# EasyEDA Pro project tinyProto_2026-02-20.epro

# Schematic tinyProto
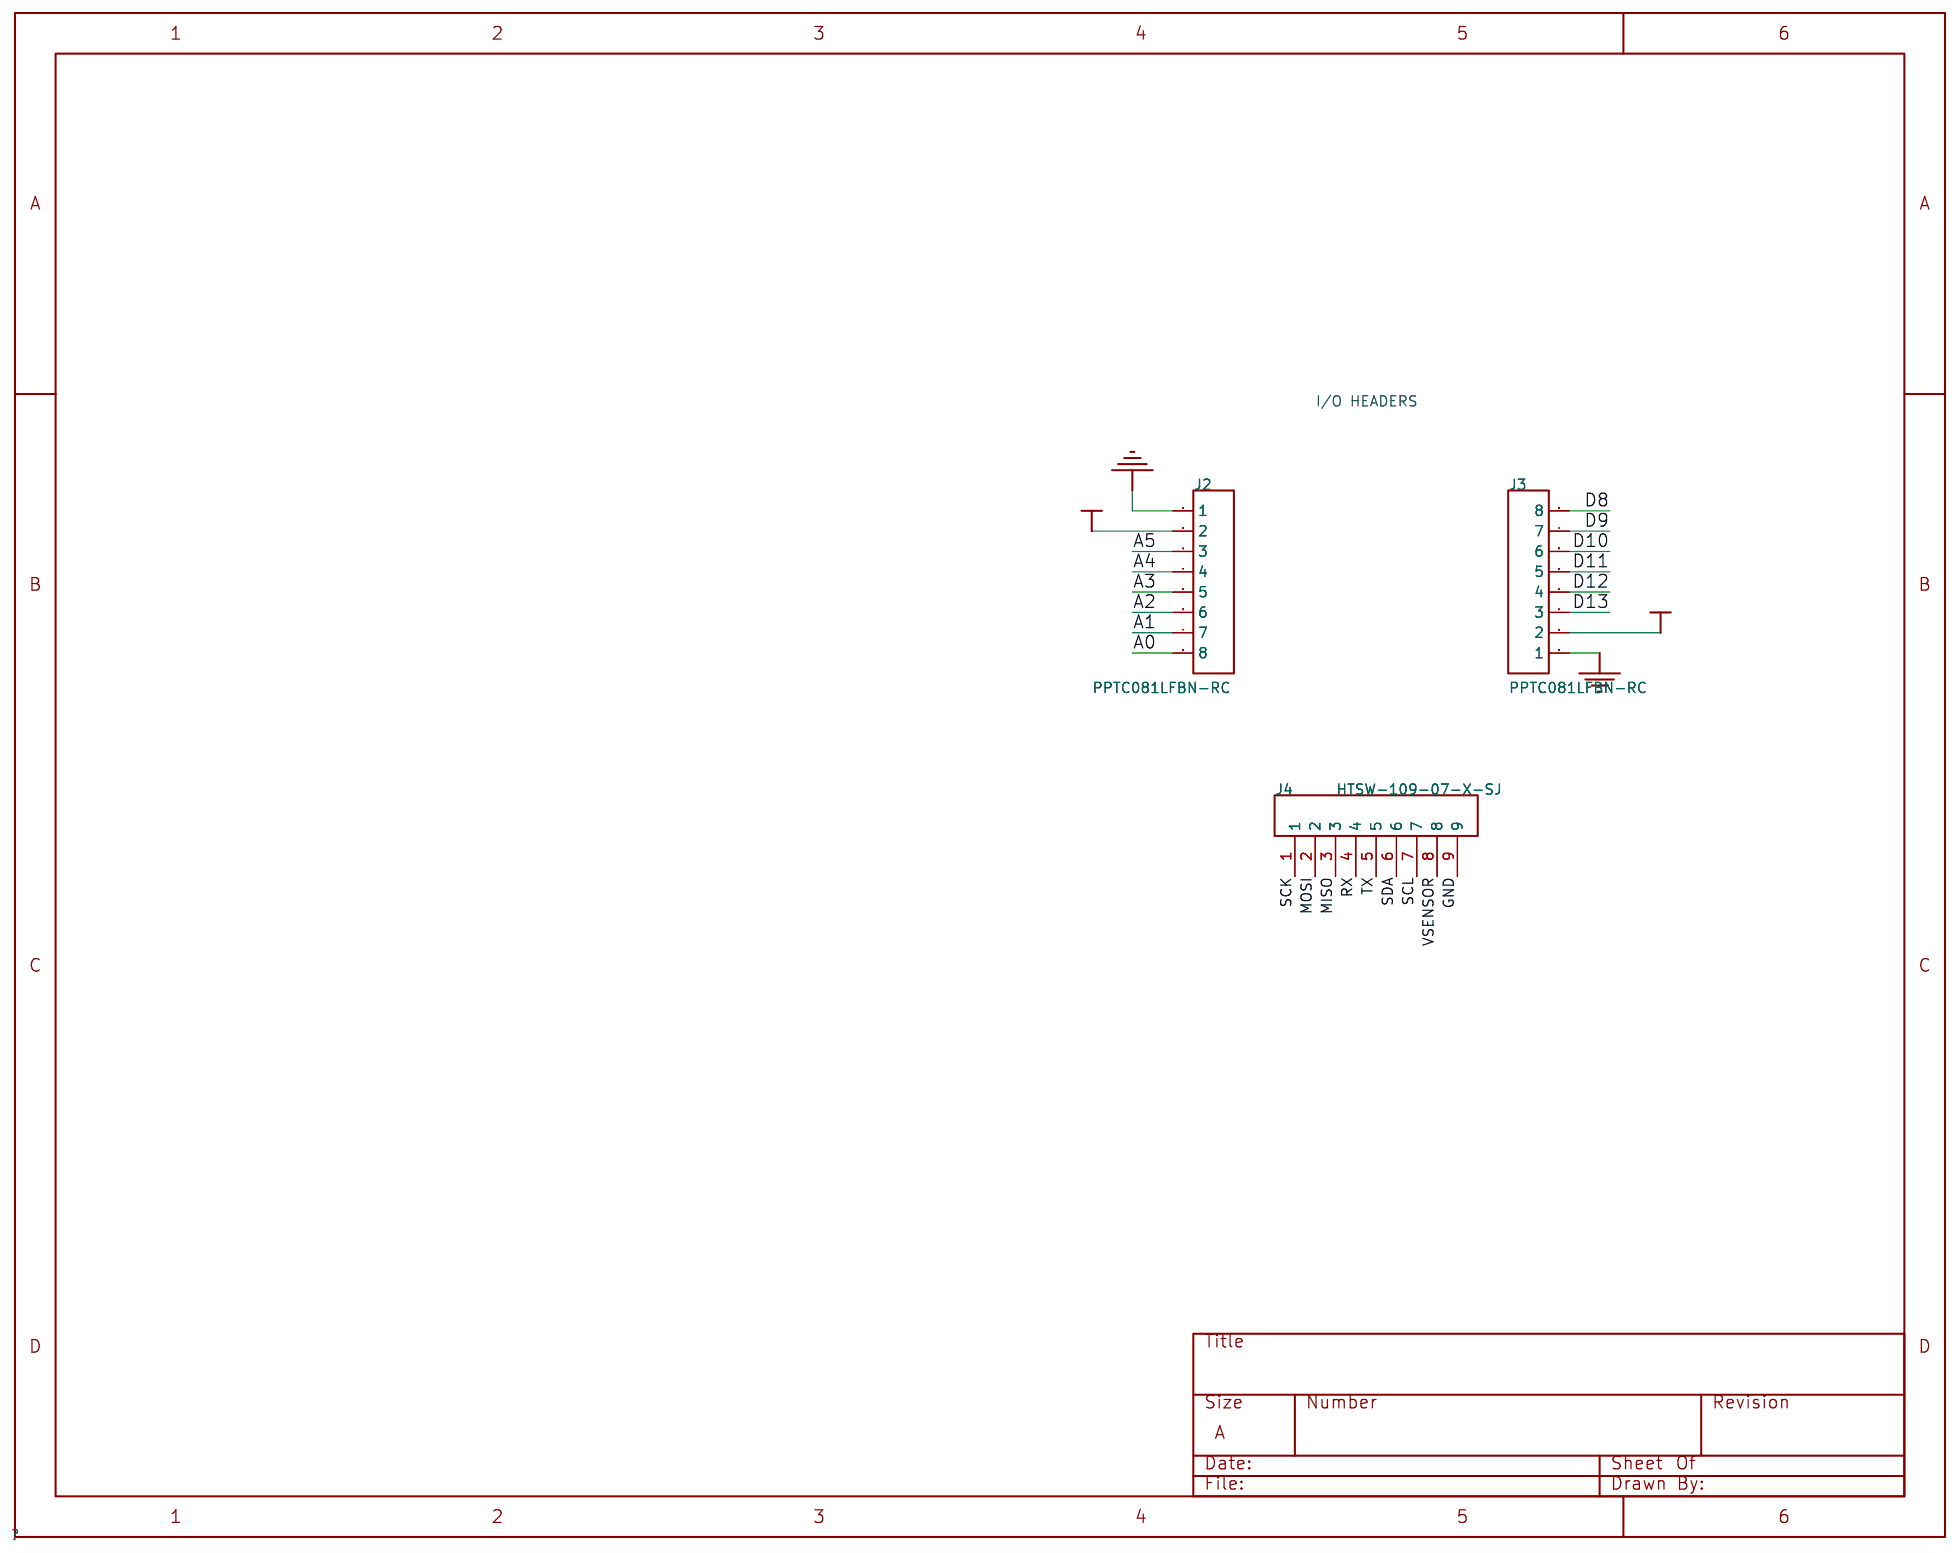
[diagram p0: schematic sheet]

## Parts
J2  PPTC081LFBN-RC  [8_PIN_100MIL - Female]
J3  PPTC081LFBN-RC  [8_PIN_100MIL - Female]
J4  HTSW-109-07-X-SJ  [JM-9_HTSW-109-07-X-S]

## Library data of the parts
J2 J3 = PPTC081LFBN-RC: 8 Position Header Connector 0.100" (2.54mm) Through Hole Tin; Digikey Link: https://www.digikey.com/product-detail/en/PPTC081LFBN-RC/S7006-ND/810147/?itemSeq=304982354; Type: Extended; LCSC Part#: C27438; Design Item ID: JF_8_PIN_FEMALE; Library Name: ECEN5730Lib_2023_05_DS (2)
J4 = HTSW-109-07-X-SJ: 2.54mm Black 1x9P Straight,P=2.54mm Pin Headers; MFR PART #: PZ254-1-09-Z-8.5; LCSC PART#: C2894932; Design Item ID: JM_9_PIN_MALE; Library Name: ECEN5730Lib_2023_05_DS (2)

## Nets
3V3: J2.2 J3.2
GND: J2.1 J3.1 J4.9
A0: J2.8
A1: J2.7
A2: J2.6
A3: J2.5
A4: J2.4
A5: J2.3
D8: J3.8
D9: J3.7
D10: J3.6
D11: J3.5
D12: J3.4
D13: J3.3
MISO: J4.3
MOSI: J4.2
RX: J4.4
SCK: J4.1
SCL: J4.7
SDA: J4.6
TX: J4.5
VSENSOR: J4.8

## Notes on the sheet
- I/O HEADERS

# Board tinyProto
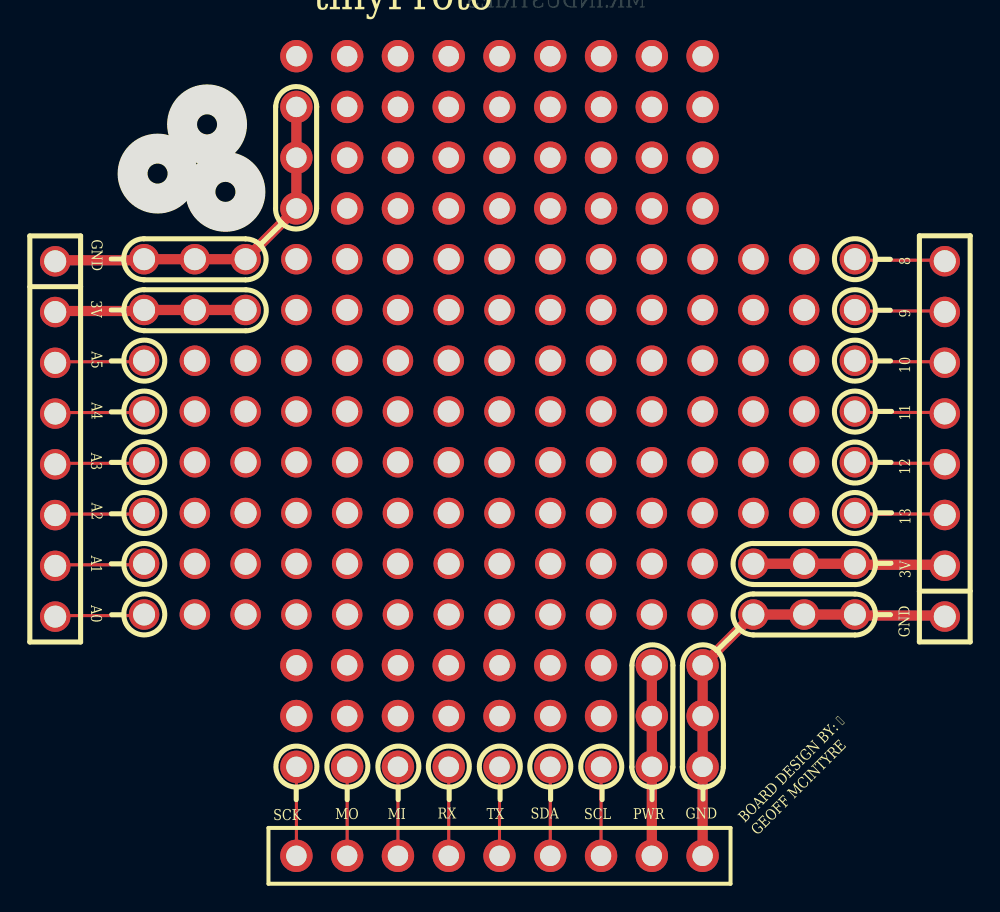
[diagram p1: board, top side]
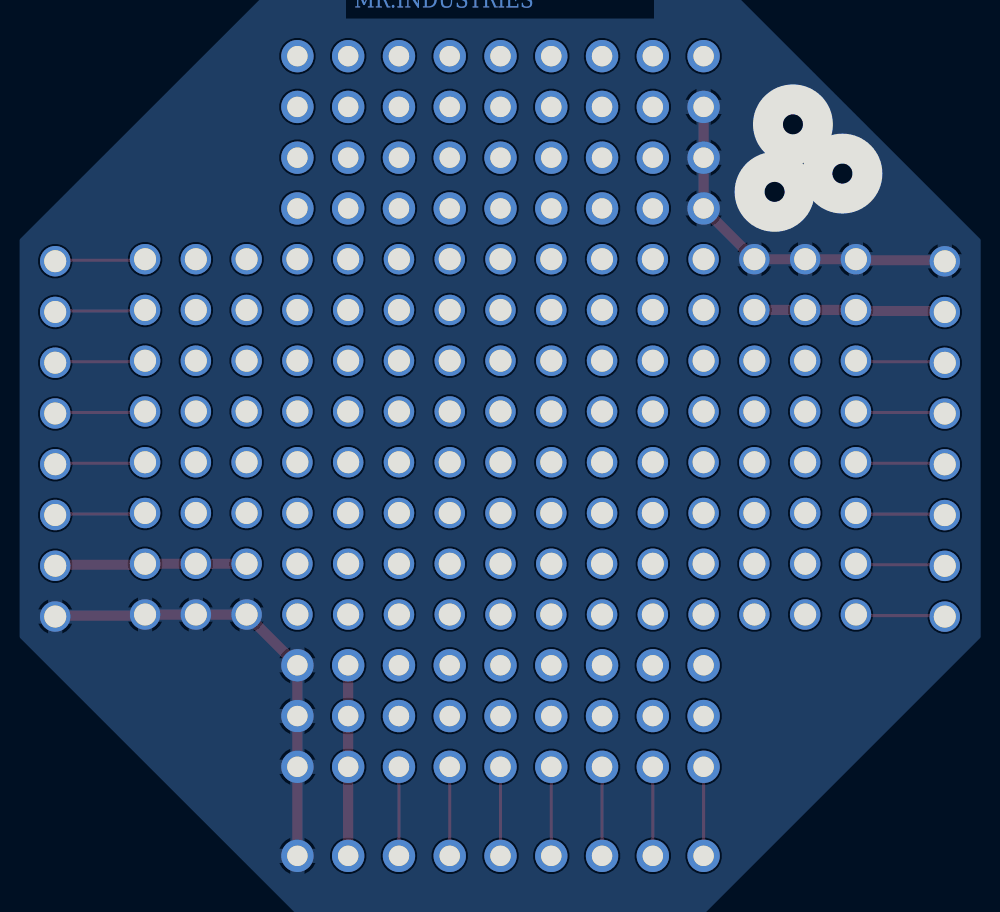
[diagram p2: board, bottom side, seen from below]

Outline 4.39 x 4.38 mm; copper layers: Top Layer, Bottom Layer. Coordinates in mm from the lower left corner of the outline.
Outline path: circle c0.5,1.41 r0.5 ; circle c2.98,3.88 r0.5 ; circle c3.89,0.5 r0.5
Stack: Top Layer 0.035mm / Core 1.065mm FR-4 er 4.5 / Bottom Layer 0.035mm

## Design rules (mm)
spacing BoardOutlineClearance: track to track 0.089, other pairs 0.089 to 0.254
spacing Clearance: track to track 0.089, other pairs 0.089 to 0.254
spacing Clearance Top Layer: track to track 0.203, other pairs 0.2 to 0.254
spacing Clearance Bottom Layer: track to track 0.203, other pairs 0.2 to 0.254
spacing safeClearance (default): track to track 0.089, other pairs 0.089 to 0.254
track width IMP: min 0.254, default 0.254, max 0.508
track width Width (default): min 0.089, default 0.089, max 2.54
differential pair DiffPairsRouting (default): width min 0.381, default 0.381, max 0.381; gap min 0.254, default 0.254
via RoutingVias (default): diameter min 0.66, default 0.66, max 0.66; hole min 0.33, default 0.33, max 0.33

## Placement (name value [footprint] x y rotation side)
Designator34  Comment  [8_PIN_100MIL-Male]  32.84 -20.65 90 top
Designator35  Comment  [8_PIN_100MIL-Male]  30.3 -20.65 90 top
Designator36  Comment  [8_PIN_100MIL-Male]  27.76 -20.65 90 top
Designator37  Comment  [8_PIN_100MIL-Male]  25.22 -20.65 90 top
Designator38  Comment  [8_PIN_100MIL-Male]  22.68 -20.65 90 top
Designator39  Comment  [8_PIN_100MIL-Male]  20.14 -20.65 90 top
Designator40  Comment  [8_PIN_100MIL-Male]  17.6 -20.65 90 top
Designator41  Comment  [8_PIN_100MIL-Male]  15.06 -20.65 90 top
Designator42  Comment  [8_PIN_100MIL-Male]  12.52 -20.65 90 top
Designator43  Comment  [8_PIN_100MIL-Male]  9.98 -20.65 90 top
Designator44  Comment  [8_PIN_100MIL-Male]  7.44 -20.65 90 top
Designator45  Comment  [8_PIN_100MIL-Male]  4.9 -20.65 90 top
Designator46  Comment  [8_PIN_100MIL-Male]  2.36 -20.65 90 top
Designator48  Comment  [JM-9_HTSW-109-07-X-S]  17.6 -23.19 0 top
Designator48_1  Comment  [JM-9_HTSW-109-07-X-S]  17.6 4.75 0 top
Designator49  Comment  [JM-9_HTSW-109-07-X-S]  17.6 -25.73 0 top
Designator49_1  Comment  [JM-9_HTSW-109-07-X-S]  17.6 2.21 0 top
Designator49_1_1  Comment  [JM-9_HTSW-109-07-X-S]  17.6 7.29 0 top
J2  PPTC081LFBN-RC  [8_PIN_100MIL - Female]  -4.62 -2.97 270 top
J2-Ext  Comment  [8_PIN_100MIL-Male]  -0.18 -20.65 90 top
J3  PPTC081LFBN-RC  [8_PIN_100MIL - Female]  39.88 -20.75 90 top
J3-Ext  Comment  [8_PIN_100MIL-Male]  35.38 -20.65 90 top
J4  HTSW-109-07-X-SJ  [JM-9_HTSW-109-07-X-S]  17.6 -32.72 0 top
J4-Ext  Comment  [JM-9_HTSW-109-07-X-S]  17.6 -28.27 0 top
J4-Ext_1  Comment  [JM-9_HTSW-109-07-X-S]  17.6 -0.33 0 top

## Footprints (pads in the part's own frame, mm; a bottom-side part is the same pattern mirrored in y, then rotated)
8_PIN_100MIL - Female
  round 1.524 hole 1.1: 1(0,0) 2(2.54,0) 3(5.08,0) 4(7.62,0) 5(10.16,0) 6(12.7,0) 7(15.24,0) 8(17.78,0)
8_PIN_100MIL-Male
  round 1.524 hole 1.1: 1(0,0) 2(2.54,0) 3(5.08,0) 4(7.62,0) 5(10.16,0) 6(12.7,0) 7(15.24,0) 8(17.78,0)
JM-9_HTSW-109-07-X-S
  round 1.62 hole 1.02: 1(-10.16,0) 2(-7.62,0) 3(-5.08,0) 4(-2.54,0) 5(0,0) 6(2.54,0) 7(5.08,0) 8(7.62,0) 9(10.16,0)

## Nets
3V3: Designator34.2 Designator35.2 Designator45.7 Designator46.7 J2.2 J2-Ext.7 J3.2 J3-Ext.2
GND: Designator34.1 Designator35.1 Designator45.8 Designator46.8 Designator48.9 Designator48_1.1 Designator49.9 Designator49_1.1 J2.1 J2-Ext.8 J3.1 J3-Ext.1 J4.9 J4-Ext.9 J4-Ext_1.1
A0: J2.8 J2-Ext.1
A1: J2.7 J2-Ext.2
A2: J2.6 J2-Ext.3
A3: J2.5 J2-Ext.4
A4: J2.4 J2-Ext.5
A5: J2.3 J2-Ext.6
D8: J3.8 J3-Ext.8
D9: J3.7 J3-Ext.7
D10: J3.6 J3-Ext.6
D11: J3.5 J3-Ext.5
D12: J3.4 J3-Ext.4
D13: J3.3 J3-Ext.3
MISO: J4.3 J4-Ext.3
MOSI: J4.2 J4-Ext.2
RX: J4.4 J4-Ext.4
SCK: J4.1 J4-Ext.1
SCL: J4.7 J4-Ext.7
SDA: J4.6 J4-Ext.6
TX: J4.5 J4-Ext.5
VSENSOR: Designator48.8 Designator49.8 J4.8 J4-Ext.8

Pads without a net: Designator34 3 4 5 6 7 8; Designator35 3 4 5 6 7 8; Designator36 1 2 3 4 5 6 7 8; Designator37 1 2 3 4 5 6 7 8; Designator38 1 2 3 4 5 6 7 8; Designator39 1 2 3 4 5 6 7 8; Designator40 1 2 3 4 5 6 7 8; Designator41 1 2 3 4 5 6 7 8; Designator42 1 2 3 4 5 6 7 8; Designator43 1 2 3 4 5 6 7 8; Designator44 1 2 3 4 5 6 7 8; Designator45 1 2 3 4 5 6; Designator46 1 2 3 4 5 6; Designator48 1 2 3 4 5 6 7; Designator48_1 2 3 4 5 6 7 8 9; Designator49 1 2 3 4 5 6 7; Designator49_1 2 3 4 5 6 7 8 9; Designator49_1_1 1 2 3 4 5 6 7 8 9; J4-Ext_1 2 3 4 5 6 7 8 9

## Routing (per net, layer and track width the routed paths; a pad name or vN(x,y) marks a point on that pad's centre or on a via; arc(x,y) is an arc through that point)
3V3: length 19.4
  Top Layer w0.508: J2.2 -4.57,-5.46 -0.18,-5.46 ; J2-Ext.7 Designator46.7 Designator45.7 5.04,-5.41 5.05,-5.4 ; 35.38,-18.11 30.17,-18.11 30.1,-18.17 ; 35.49,-18.16 39.83,-18.16 J3.2
GND: length 40.6
  Top Layer w0.508: J3-Ext.1 Designator34.1 30.43,-20.65 ; J3.1 39.83,-20.7 35.38,-20.7 ; 27.76,-25.66 Designator48.9 ; Designator45.8 7.35,-0.42 ; 7.23,5.13 7.44,4.91 Designator48_1.1 Designator49_1.1 J4-Ext_1.1 ; 27.8,-23.15 Designator35.1 ; J4-Ext.9 27.76,-25.94 27.83,-25.87 ; J2-Ext.8 2.32,-2.87 ; -0.18,-2.92 -4.57,-2.92 J2.1 ; 27.6,-28.5 27.76,-28.66 J4.9 ; Designator46.8 4.83,-2.87
A0: length 4.6
  Top Layer w0.152: J2.8 -4.57,-20.7 -0.07,-20.7 -0.05,-20.67
A1: length 4.2
  Top Layer w0.152: -0.45,-18.12 -0.48,-18.16 -4.57,-18.16 J2.7
A2: length 4.8
  Top Layer w0.152: 0.1,-15.47 -0.04,-15.62 -4.57,-15.62 J2.6
A3: length 4.7
  Top Layer w0.152: 0,-12.95 -0.13,-13.08 -4.57,-13.08 J2.5
A4: length 4.6
  Top Layer w0.152: J2.4 -4.57,-10.54 -0.14,-10.54 -0.05,-10.45
A5: length 4.6
  Top Layer w0.152: J2.3 -4.57,-8 -0.12,-8 -0.1,-8.02
D8: length 4.6
  Top Layer w0.152: J3.8 39.83,-2.92 35.38,-2.92 35.33,-2.97
D9: length 4.6
  Top Layer w0.152: J3.7 39.83,-5.46 35.32,-5.46 35.28,-5.5
D10: length 4.7
  Top Layer w0.152: 35.23,-7.97 35.25,-8 39.83,-8 J3.6
D11: length 4.7
  Top Layer w0.152: J3.5 39.83,-10.54 35.29,-10.54 35.23,-10.47
D12: length 4.6
  Top Layer w0.152: 35.3,-13.05 35.33,-13.08 39.83,-13.08 J3.4
D13: length 4.4
  Top Layer w0.152: 35.48,-15.6 35.5,-15.62 39.83,-15.62 J3.3
MISO: length 4.6
  Top Layer w0.152: 12.58,-28.17 12.52,-28.23 J4.3
MOSI: length 4.7
  Top Layer w0.152: 10.05,-28.07 9.98,-28.14 J4.2
RX: length 4.6
  Top Layer w0.152: 15.13,-28.17 15.06,-28.24 J4.4
SCK: length 4.4
  Top Layer w0.152: 7.4,-28.32 7.44,-28.36 J4.1
SCL: length 4.6
  Top Layer w0.152: 22.48,-28.25 22.68,-28.45 J4.7
SDA: length 4.2
  Top Layer w0.152: J4.6 20.14,-28.61 20.2,-28.55
TX: length 4.5
  Top Layer w0.152: 17.53,-28.25 17.6,-28.32 J4.5
VSENSOR: length 9.6
  Top Layer w0.508: J4.8 25.22,-28.3 ; J4-Ext.8 Designator49.8 25.22,-23.19 25.18,-23.15

## Copper pours and planes (outline as drawn; the poured copper is in the pictures)
GND on Bottom Layer: -6.52,-35.97 41.76,-35.97 41.76,12.29 -6.52,12.29

## Text on the board
Bottom Layer: MR.INDUSTRIES
Top Silkscreen Layer: SCK | MO | MI | RX | TX | SDA | SCL | PWR | GND | BOARD DESIGN BY: / GEOFF MCINTYRE | 8 | 9 | 10 | 11 | 12 | 13 | 3V | A3 | A1 | A0 | A5 | A4 | A2 | tinyProto
